# Altium schematic sheet STM32MP25XXAK I_Os.SchDoc: STM32MP25XXAK  I/Os
size A3; Date: Not used; ApprovedBy: Not used; CheckedBy: Not used; Author: Not used; CompanyName: STMicroelectronics; DrawnBy: Not used; Engineer: Not used; Organization: Not used; Address1: Not used; Address2: Not used; Address3: Not used; Address4: Not used; DocumentNumber: Not used; Revision: Not used; SheetNumber: 3; SheetTotal: 7; CurrentTime: Not used; CurrentDate: Not used; Time: Not used; DocumentFullPathAndName: Not used; DocumentName: Not used; ModifiedDate: Not used; ImagePath: Not used; ProjectName: Not used; Application_BuildNumber: Not used
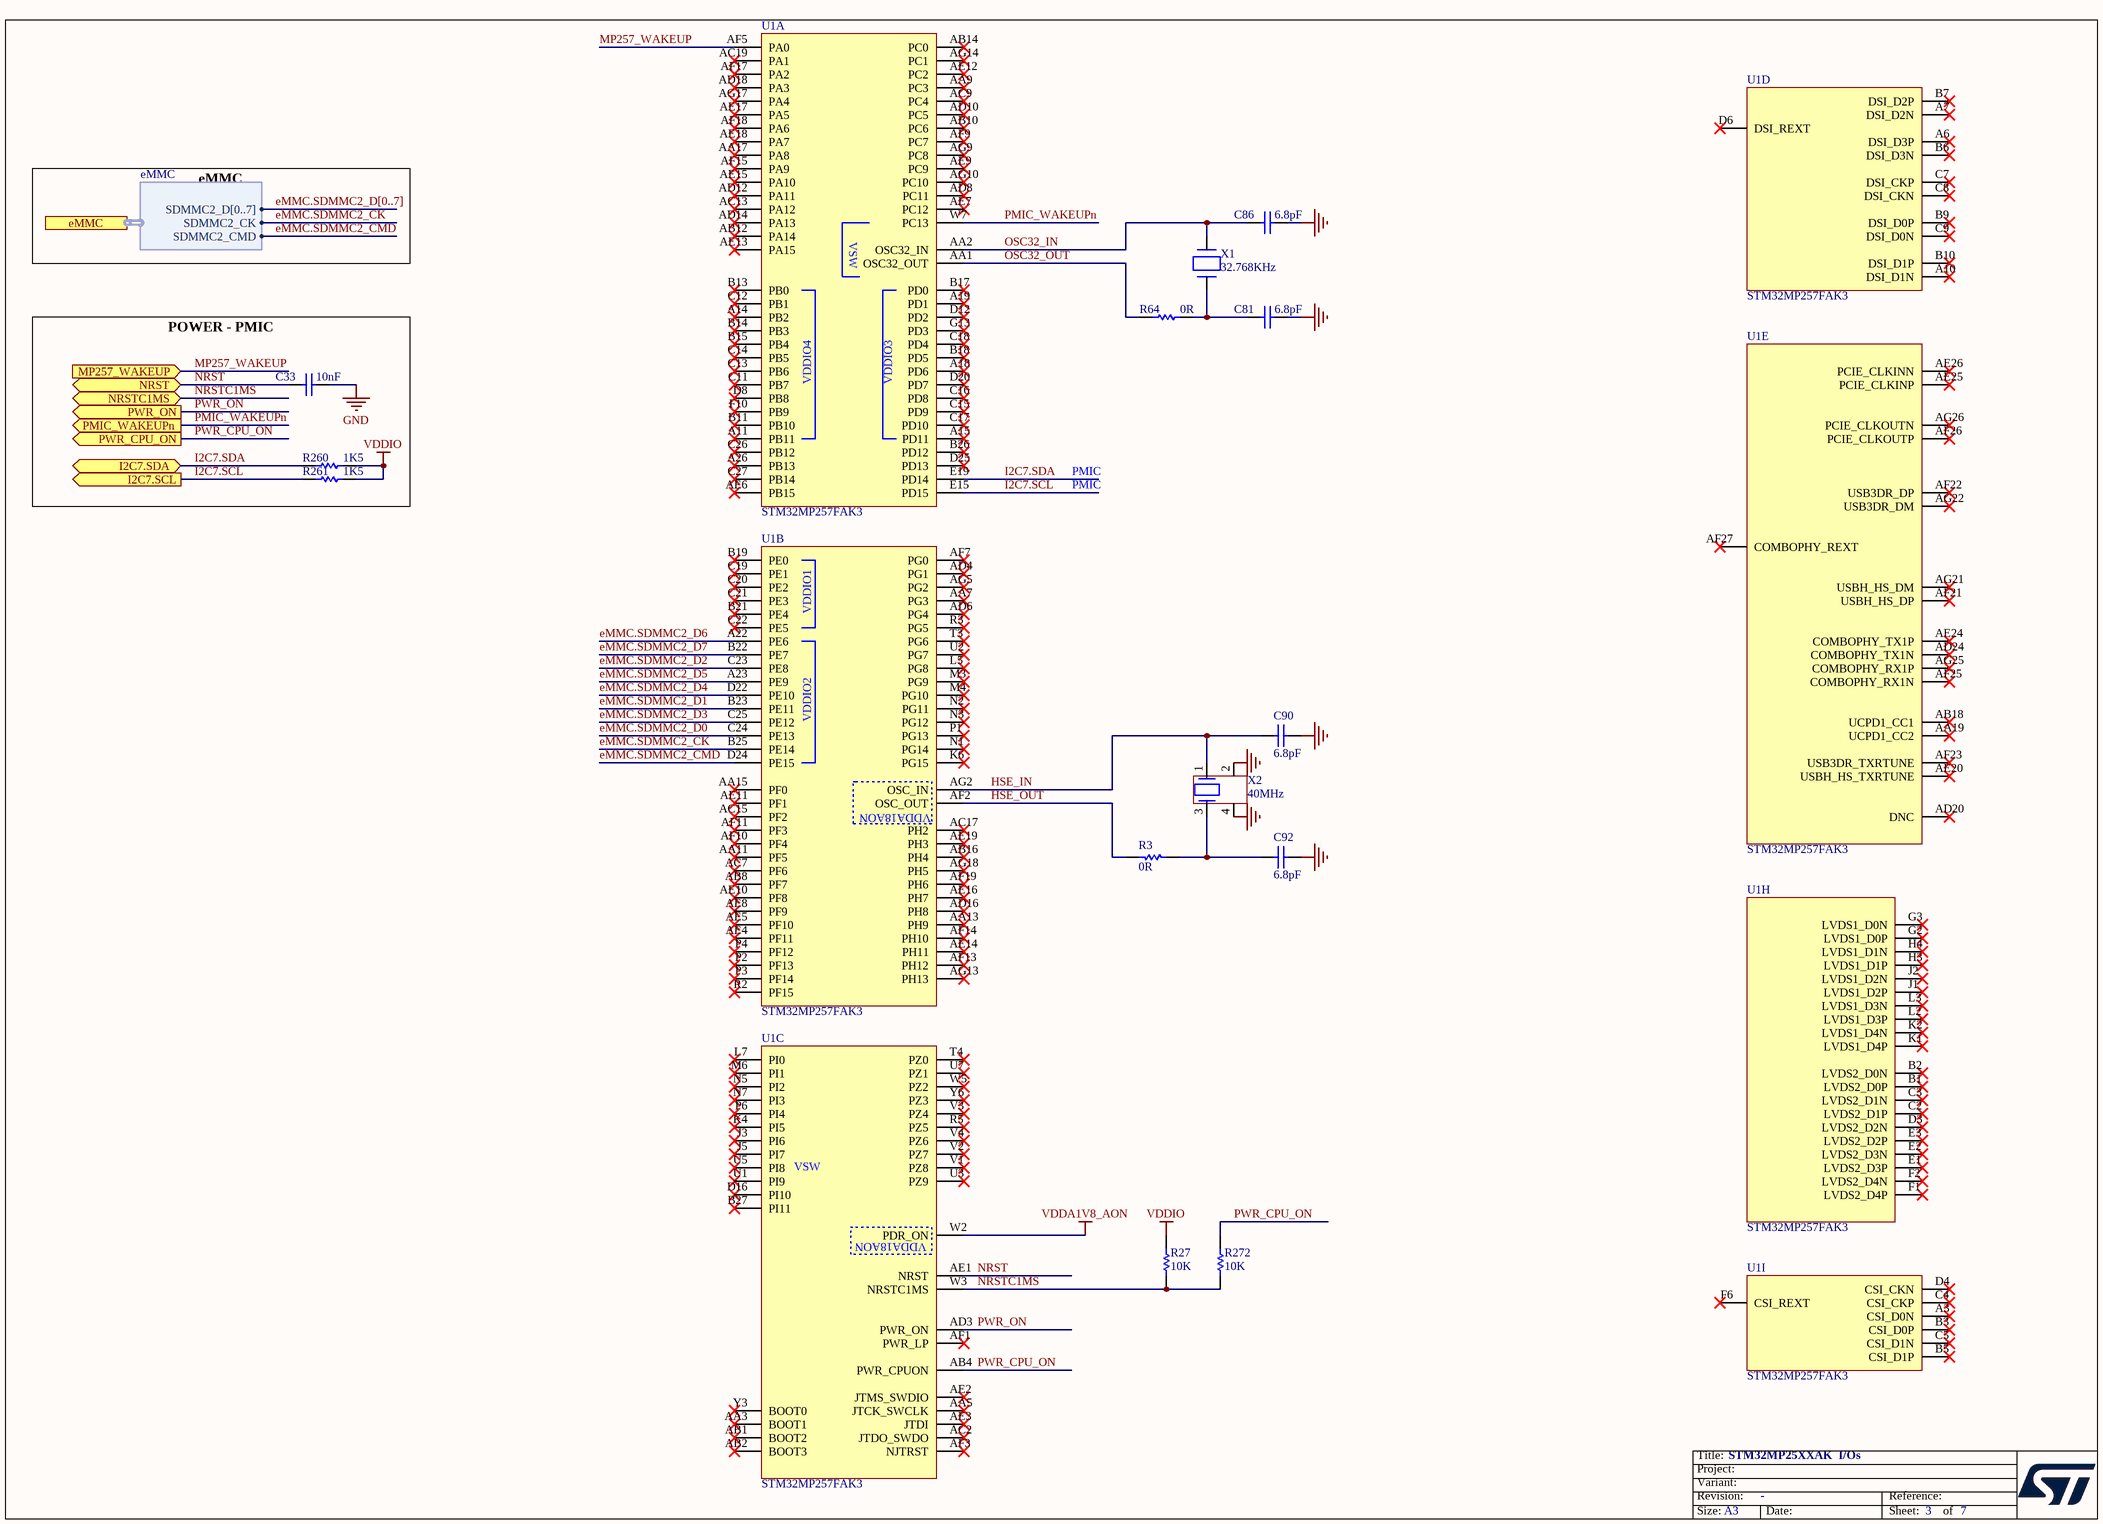
[diagram p0: STM32MP25XXAK I_Os.SchDoc]

## Parts
C33  value 10nF  [C0402]  (hidden comment: Capacitor)
C81  value 6.8pF  [C0402]  (hidden comment: Capacitor)
C86  value 6.8pF  [C0402]  (hidden comment: Capacitor)
C90  value 6.8pF  [C0402]  (hidden comment: Capacitor)
C92  value 6.8pF  [C0402]  (hidden comment: Capacitor)
R3  value 0R  [R0402]
R27  value 10K  [R0402]  (hidden comment: Resistor)
R64  value 0R  [R0402]
R260  value 1K5  [R0402]  (hidden comment: Resistor)
R261  value 1K5  [R0402]  (hidden comment: Resistor)
R272  value 10K  [R0402]  (hidden comment: Resistor)
U1  STM32MP257FAK3  [ICC_TFBGA424_14X14_P050_H1P20_CODE-B0A2]  (parts A,B,C,D,E,H,I of 9)
X1  value 32.768KHz  [CRY_NX2012SA_2P]  (hidden comment: XTAL_2_PINS)
X2  value 40MHz  [CRY_NX1612SA_4P]  (hidden comment: XTAL_4_PINS)

## Ports
eMMC (harness eMMC), I2C7.SCL (out), I2C7.SDA (bidir), MP257_WAKEUP (in), NRST (bidir), NRSTC1MS (bidir), PMIC_WAKEUPn (out), PWR_CPU_ON (out), PWR_ON (out)

## Harnesses
eMMC: SDMMC2_CK, SDMMC2_CMD, SDMMC2_D[0..7]

## Nets
GND: C33.1 C81.2 C86.2 C90.1 C92.2 X2.2 X2.4
VDDA1V8_AON: U1.W2(PDR_ON)
VDDIO: R27.2 R260.2 R261.2
eMMC.SDMMC2_CK: U1.B25(PE14) ; port eMMC.SDMMC2_CK
eMMC.SDMMC2_CMD: U1.D24(PE15) ; port eMMC.SDMMC2_CMD
eMMC.SDMMC2_D0: U1.C24(PE13)
eMMC.SDMMC2_D1: U1.B23(PE11)
eMMC.SDMMC2_D2: U1.C23(PE8)
eMMC.SDMMC2_D3: U1.C25(PE12)
eMMC.SDMMC2_D4: U1.D22(PE10)
eMMC.SDMMC2_D5: U1.A23(PE9)
eMMC.SDMMC2_D6: U1.A22(PE6)
eMMC.SDMMC2_D7: U1.B22(PE7)
HSE_IN: C90.2 U1.AG2(OSC_IN) X2.1
HSE_OUT: R3.2 U1.AF2(OSC_OUT)
I2C7.SCL: R261.1 U1.E15(PD15) ; port I2C7.SCL
I2C7.SDA: R260.1 U1.E19(PD14) ; port I2C7.SDA
MP257_WAKEUP: U1.AF5(PA0) ; port MP257_WAKEUP
NRST: C33.2 U1.AE1(NRST) ; port NRST
NRSTC1MS: R27.1 R272.1 U1.W3(NRSTC1MS) ; port NRSTC1MS
OSC32_IN: C86.1 U1.AA2(OSC32_IN) X1.2(X2)
OSC32_OUT: R64.1 U1.AA1(OSC32_OUT)
PMIC_WAKEUPn: U1.W7(PC13) ; port PMIC_WAKEUPn
PWR_CPU_ON: R272.2 U1.AB4(PWR_CPUON) ; port PWR_CPU_ON
PWR_ON: U1.AD3(PWR_ON) ; port PWR_ON
NetC81_1: C81.1 R64.2 X1.1(X1)
NetC92_1: C92.1 R3.1 X2.3

Not connected (* = marked no-connect by the designer): U1 A3(CSI_D0N)* A6(DSI_D3P)* A7(DSI_D2N)* A10(DSI_D1N)* A11(PB11)* A14(PB2)* A15(PD11)* A18(PD6)* A19(PD1)* A26(PB13)* AA3(BOOT1)* AA5(JTCK_SWCLK)* AA7(PG3)* AA9(PC3)* AA11(PF5)* AA13(PH9)* AA15(PF0)* AA17(PA8)* AA19(UCPD1_CC2)* AB1(BOOT2)* AB2(BOOT3)* AB8(PF7)* AB10(PC6)* AB12(PA14)* AB14(PC0)* AB16(PH4)* AB18(UCPD1_CC1)* AC2(JTDO_SWDO)* AC7(PF6)* AC9(PC4)* AC13(PA12)* AC15(PF2)* AC17(PH2)* AC19(PA1)* AD4(PG1)* AD6(PG4)* AD8(PC11)* AD10(PC5)* AD12(PA11)* AD14(PA13)* AD16(PH8)* AD18(PA3)* AD20(DNC)* AD24(COMBOPHY_TX1N)* AE2(JTMS_SWDIO)* AE3(JTDI)* AE4(PF11)* AE5(PF10)* AE6(PB15)* AE7(PC12)* AE8(PF9)* AE9(PC9)* AE10(PF8)* AE11(PF1)* AE12(PC2)* AE13(PA15)* AE14(PH11)* AE15(PA10)* AE16(PH7)* AE17(PA5)* AE18(PA7)* AE19(PH3)* AE20(USBH_HS_TXRTUNE)* AE24(COMBOPHY_TX1P)* AE25(PCIE_CLKINP)* AE26(PCIE_CLKINN)* AF1(PWR_LP)* AF3(NJTRST)* AF7(PG0)* AF9(PC7)* AF10(PF4)* AF11(PF3)* AF13(PH12)* AF14(PH10)* AF15(PA9)* AF17(PA2)* AF18(PA6)* AF19(PH6)* AF21(USBH_HS_DP)* AF22(USB3DR_DP)* AF23(USB3DR_TXRTUNE)* AF25(COMBOPHY_RX1N)* AF26(PCIE_CLKOUTP)* AF27(COMBOPHY_REXT)* AG5(PG2)* AG9(PC8)* AG10(PC10)* AG13(PH13)* AG14(PC1)* AG17(PA4)* AG18(PH5)* AG21(USBH_HS_DM)* AG22(USB3DR_DM)* AG25(COMBOPHY_RX1P)* AG26(PCIE_CLKOUTN)* B1(LVDS2_D0P)* B2(LVDS2_D0N)* B3(CSI_D0P)* B5(CSI_D1P)* B6(DSI_D3N)* B7(DSI_D2P)* B9(DSI_D0P)* B10(DSI_D1P)* B11(PB10)* B13(PB0)* B14(PB3)* B15(PB4)* B17(PD0)* B18(PD5)* B19(PE0)* B21(PE4)* B26(PD12)* B27(PI11)* C2(LVDS2_D1P)* C3(LVDS2_D1N)* C4(CSI_CKP)* C5(CSI_D1N)* C7(DSI_CKP)* C8(DSI_CKN)* C9(DSI_D0N)* C11(PB7)* C12(PB1)* C13(PB6)* C14(PB5)* C15(PD9)* C16(PD8)* C17(PD10)* C18(PD4)* C19(PE1)* C20(PE2)* C21(PE3)* C22(PE5)* C26(PB12)* C27(PB14)* D3(LVDS2_D2N)* D4(CSI_CKN)* D6(DSI_REXT)* D8(PB8)* D12(PD2)* D16(PI10)* D20(PD7)* D25(PD13)* E1(LVDS2_D3P)* E2(LVDS2_D3N)* E3(LVDS2_D2P)* F1(LVDS2_D4P)* F2(LVDS2_D4N)* F6(CSI_REXT)* F10(PB9)* G2(LVDS1_D0P)* G3(LVDS1_D0N)* G13(PD3)* H3(LVDS1_D1P)* H4(LVDS1_D1N)* J1(LVDS1_D2P)* J2(LVDS1_D2N)* J3(PI6)* J5(PI7)* K1(LVDS1_D4P)* K2(LVDS1_D4N)* K4(PI5)* K6(PG15)* L2(LVDS1_D3P)* L3(LVDS1_D3N)* L5(PG8)* L7(PI0)* M3(PG9)* M4(PG10)* M6(PI1)* N1(PG14)* N2(PG11)* N3(PG12)* N5(PI2)* N7(PI3)* P1(PG13)* P2(PF13)* P3(PF14)* P4(PF12)* P6(PI4)* R2(PF15)* R3(PG5)* R5(PZ5)* T3(PG6)* T4(PZ0)* U1(PI9)* U2(PG7)* U3(PZ9)* U5(PI8)* U7(PZ1)* V1(PZ8)* V2(PZ7)* V3(PZ4)* V4(PZ6)* W5(PZ2)* Y3(BOOT0)* Y6(PZ3)*

## Buses and harness runs
bus eMMC.SDMMC2_D[0..7]

## Notes on the sheet
- eMMC
- POWER - PMIC
- PMIC
- Title:
- Project:
- Size:
- Revision:
- Variant:
- A3
- -
- Date:
- Reference:
- Sheet:
- of
- (in symbol MCD-03375, part A) VSW
- (in symbol MCD-03375, part C) VSW

## Library data of the parts
C33 = MCD-00011: Capacitor, MLCC, 10nF, 16V, X7R, 10%, 0402, T=0.5mm; Manufacturer_Part_Number: CC0402KRX7R7BB103; Manufacturer: YAGEO; Provided_By: SUBCO; Initial_Board_Reference: MB1274; Internal_Part_Number: MCD-00011; Status: Released; Part_Type: Capacitor; Package: C0402; ComponentLink1Description: Datasheet; ComponentLink1URL: http://tunmcdsvn.tun.st.com/Component_Datasheet_Library/Trunk/Capacitors/Yageo_Multilayer_Capacitor_X7R_series_100pF_to_22uF; ECCN_US: n/a; ECCN_EU: n/a
C81 C86 = MCD-00674: Capacitor, MLCC, 6.8pF, 50V, NPO, +-0.25pF, 0402, T=0.5mm; Manufacturer_Part_Number: CC0402CRNPO9BN6R8; Manufacturer: YAGEO; Part_Preference: Recommended; Provided_By: SUBCO; Initial_Board_Reference: MB1319; Path: ws/MCD_ApplicationBoards/Lists/MCDPARTSdatabase; Item Type: Item; Component_Country_Of_Origin: China; ID: 3068; ShowFields: YES; Internal_Part_Number: MCD-00674; Status: Released; Part_Type: Capacitor; Package: 0402; ComponentLink1Description: Datasheet; ComponentLink1URL: http://tunmcdsvn.tun.st.com/Component_Documentation_Library/Trunk/Capacitor/YAGEO_NP0_Series; Alternate_Manufacturer: N/A; Alternate_Manufacturer_Part_Number: N/A; Order_Code_Digikey: 311-3327-1-ND; Order_Code_Farnell: N/A; Order_Code_RS: N/A
C90 C92 = MCD-00674: Capacitor, MLCC, 6.8pF, 50V, NPO, +-0.25pF, 0402, T=0.5mm; Manufacturer_Part_Number: CC0402CRNPO9BN6R8; Manufacturer: YAGEO; Part_Preference: Recommended; Provided_By: SUBCO; Initial_Board_Reference: MB1319; Component_Country_Of_Origin: China; ID: 3068; ShowFields: YES; Internal_Part_Number: MCD-00674; Status: Released; Part_Type: Capacitor; Package: 0402; ComponentLink1Description: Datasheet; ComponentLink1URL: http://tunmcdsvn.tun.st.com/Component_Documentation_Library/Trunk/Capacitor/YAGEO_NP0_Series; ECCN_US: n/a; ECCN_EU: n/a; Alternate_Manufacturer: N/A; Alternate_Manufacturer_Part_Number: N/A; Order_Code_Digikey: 311-3327-1-ND; Order_Code_Farnell: N/A; Order_Code_RS: N/A
R3 R64 = MCD-00052: Resistor,0R,0402,5%,1/16W; Manufacturer_Part_Number: RC0402JR-070RL; Manufacturer: YAGEO; Part_Preference: Recommended; Provided_By: SUBCO; Initial_Board_Reference: mb1274; Order_Code_RS: 618-5804; Component_Country_Of_Origin: China; ID: 2540; ShowFields: YES; Internal_Part_Number: MCD-00052; ComponentLink1Description: Datasheet; ECCN_US: n/a; ECCN_EU: n/a; Status: Released; Part_Type: Resistor; ComponentLink1URL: http://tunmcdsvn.tun.st.com/Component_Documentation_Library/Trunk/Resistor/YAGEO_RC_L_Series; Package: 0402; Alternate_Manufacturer: N/A; Alternate_Manufacturer_Part_Number: N/A; Order_Code_Digikey: 311-0.0JRCT-ND; Order_Code_Farnell: 9232516RL
R27 R272 = MCD-00053: Resistor,10K,0402,1%,1/16W; BMS_Part_Number: 9131590; Part_Preference: Recommended; Manufacturer: YAGEO; Manufacturer_Part_Number: RC0402FR-0710KL; Component_Country_Of_Origin: China; ID: 2539; ShowFields: YES; Internal_Part_Number: MCD-00053; Status: Released; Part_Type: Resistor; Package: 0402; ComponentLink1Description: Datasheet; ComponentLink1URL: http://tunmcdsvn.tun.st.com/Component_Documentation_Library/Trunk/Resistor/YAGEO_RC_L_Series; Order_Code_Digikey: 311-10.0KLRCT-ND; Order_Code_Farnell: 9239359; Order_Code_RS: N/A; Alternate_Manufacturer: N/A; Alternate_Manufacturer_Part_Number: N/A
R260 R261 = MCD-00068: Resistor,1K5,0402,1%,1/16W; Part_Preference: Recommended; Manufacturer: YAGEO; Manufacturer_Part_Number: RC0402FR-071K5L; Component_Country_Of_Origin: China; ID: 2524; ShowFields: YES; Internal_Part_Number: MCD-00068; Status: Released; Part_Type: Resistor; Package: 0402; ComponentLink1Description: Datasheet; ComponentLink1URL: http://tunmcdsvn.tun.st.com/Component_Documentation_Library/Trunk/Resistor/YAGEO_RC_L_Series; Order_Code_Digikey: 311-1.50KLRCT-ND; Order_Code_Farnell: 9239251; Order_Code_RS: N/A
U1 = MCD-03375: MPU , 2xCortex-A35@1.5GHz, Cortex-M33@400MHz, TFBGA 14x14, pitch 0.5, 648KB SRAM, With Crypto; Part_Type: IC; Part_Preference: Recommended; Manufacturer: STMICROELECTRONICS; Component_Country_Of_Origin: Unknown; ShowFields: YES; ID: 5491; Value: STM32MP257FAK3; Internal_Part_Number: MCD-03375; Status: Checked; Manufacturer_Part_Number: STM32MP257FAK3; Package: TFBGA; ComponentLink1URL: http://tunmcdsvn.tun.st.com/Component_Documentation_Library/Trunk/IC/STMICROELECTRONICS_STM32MP257FAK3; Order_Code_Digikey: N/A; Order_Code_Farnell: N/A; Order_Code_RS: N/A
X1 = MCD-01479: Crystal, 32.768kHz, 6pF, +/-20ppm, 80K, 2.05x1.2mm; BMS_Part_Number: 9157049; Part_Type: Crystal_Osc; Part_Preference: Recommended; Manufacturer: NDK; Manufacturer_Part_Number: NX2012SA-32.768KHZ-EXS00A-MU00527; Component_Country_Of_Origin: Unknown; ShowFields: YES; ID: 3579; Internal_Part_Number: MCD-01479; Status: Released; Package: 2.05x1.2mm; ComponentLink1URL: http://tunmcdsvn.tun.st.com/Component_Documentation_Library/Trunk/Crytal_Oscillator/NDK_NX2012SA_Series; Order_Code_Digikey: 644-1352; Order_Code_Farnell: N/A; Order_Code_RS: N/A
X2 = MCD-02344: Crystal, 40MHz, 6pF, +/-20ppm, 80R, 1.6x1.2mm; Part_Type: Crystal_Osc; Part_Preference: Recommended; Manufacturer: NDK; Manufacturer_Part_Number: NX1612SA-40MHZ-EXS00A-CS13836; Component_Country_Of_Origin: Unknown; ShowFields: YES; ID: 4450; Internal_Part_Number: MCD-02344; Status: Checked; Package: 1.6x1.2mm; ComponentLink1URL: http://tunmcdsvn.tun.st.com/Component_Documentation_Library/Trunk/Crytal_Oscillator/NDK_NX1612SA_Series/; Order_Code_Digikey: N/A; Order_Code_Farnell: N/A; Order_Code_RS: N/A